# Altium schematic sheet bicycle_V1.0.SchDoc
size A3
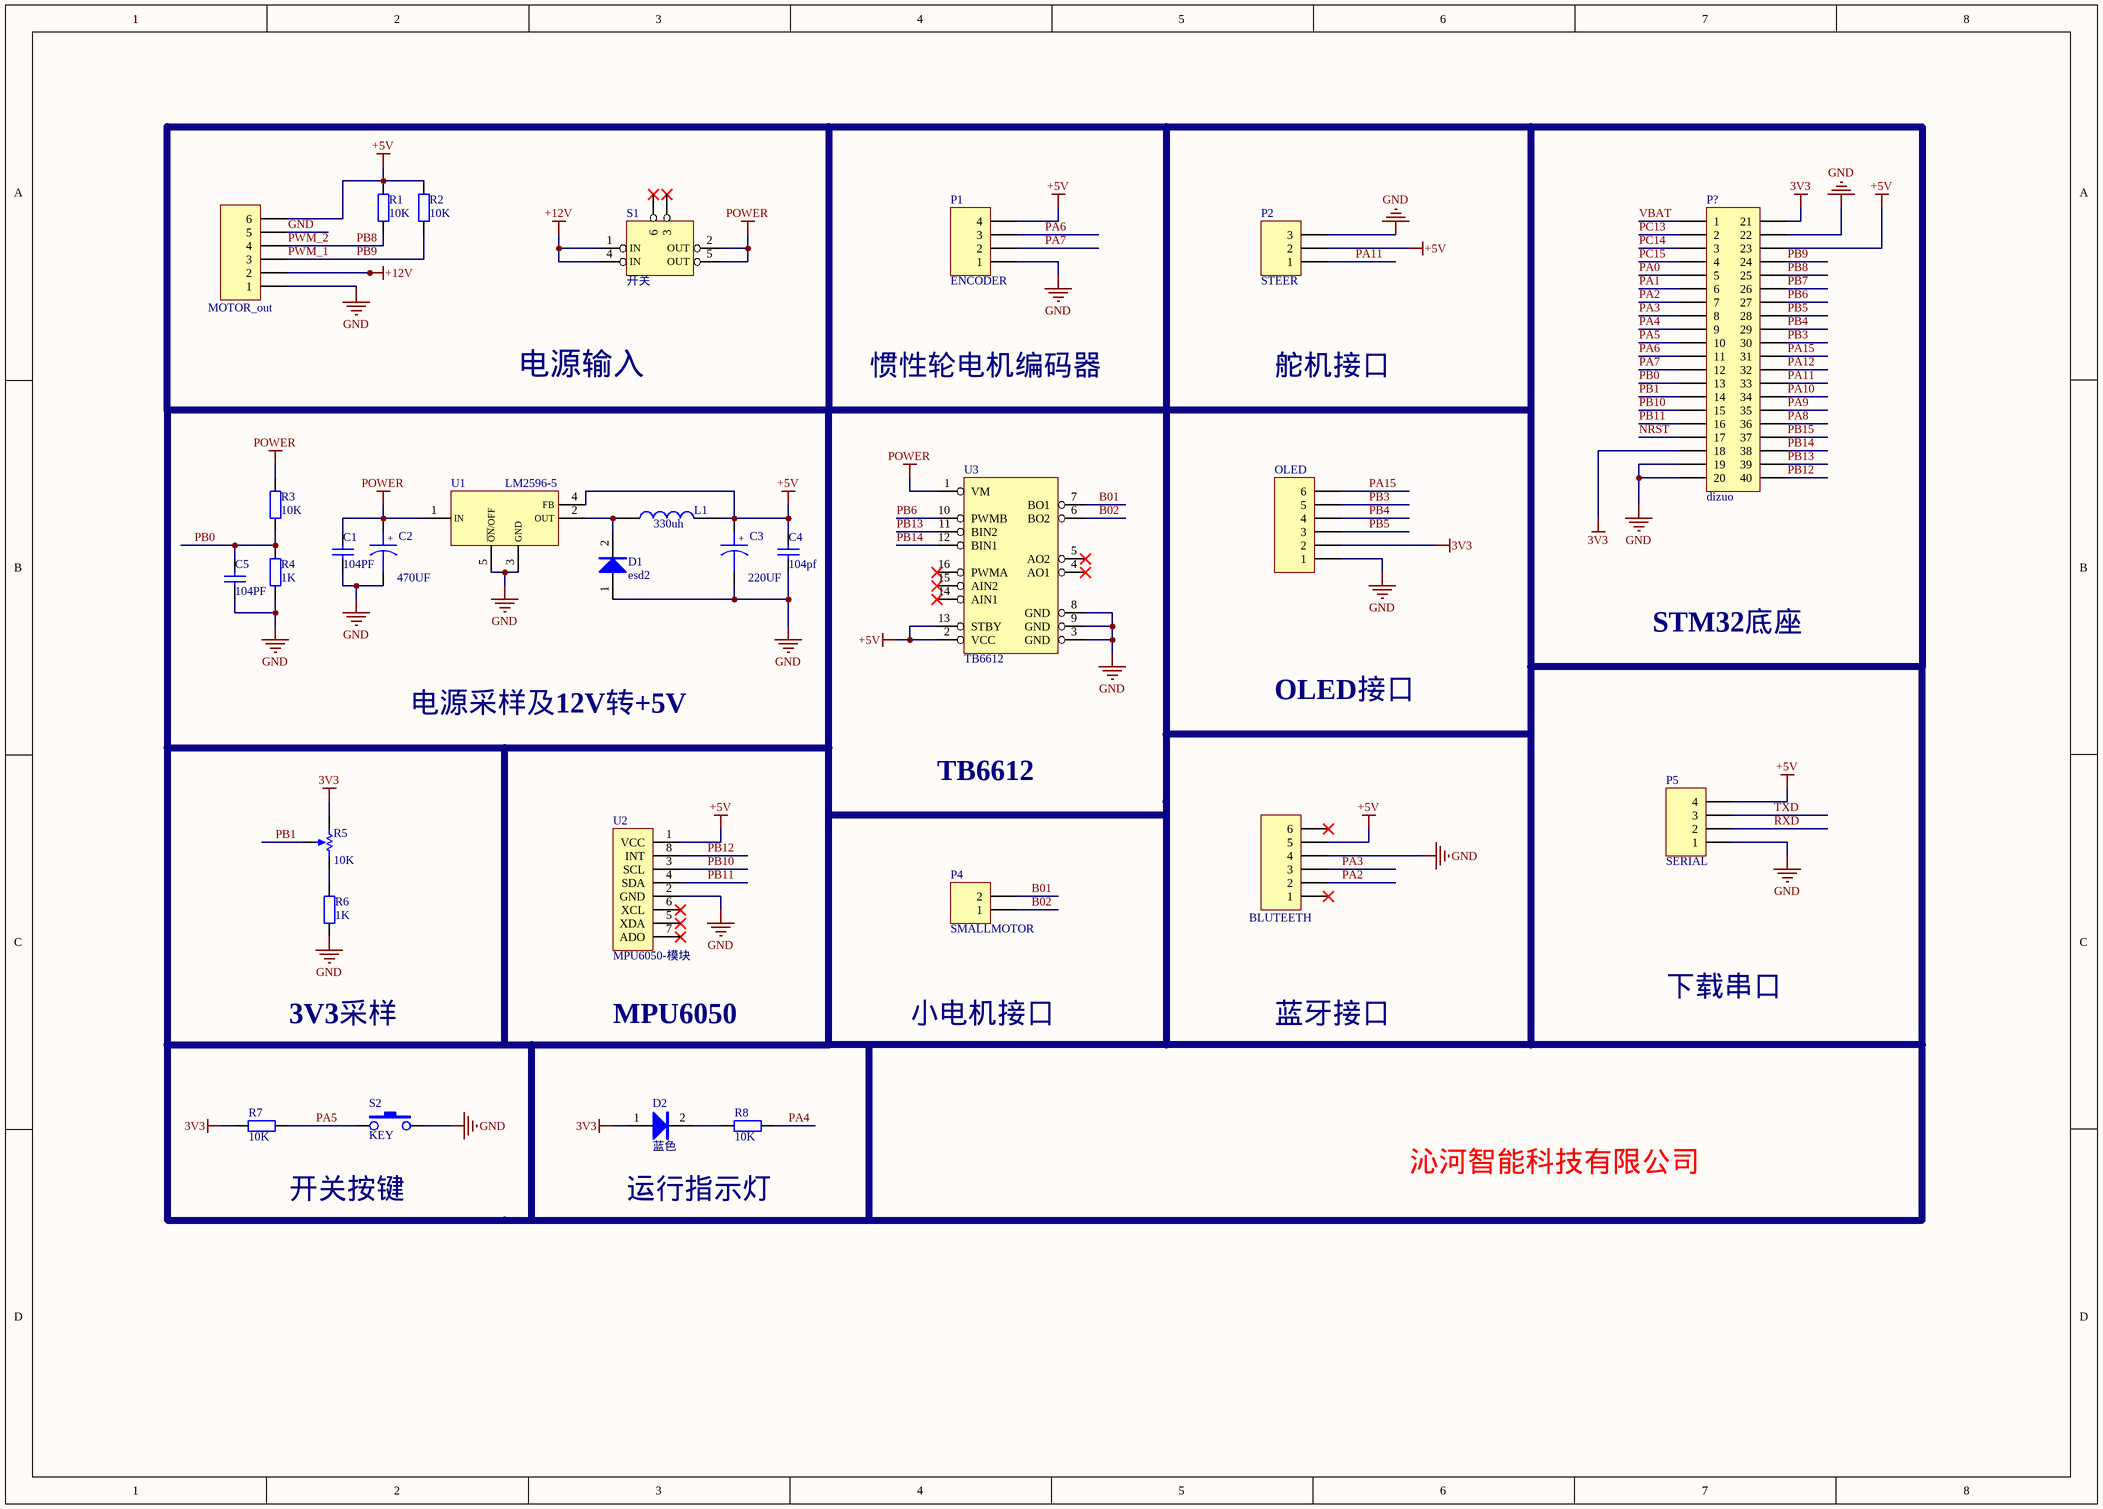
[diagram p0: bicycle_V1.0.SchDoc]

## Parts
BLUTEETH  Header 6  [MX 1.25-WI-6P]  (value not drawn)
C1  Cap  [0603L]  (value not drawn)
C2  CAP4 电解电容  [SMD-EC-F6.3]  (value not drawn)
C3  CAP4 电解电容  [SMD-EC-F6.3]  (value not drawn)
C4  Cap  [0603L]  (value not drawn)
C5  Cap  [0603L]  (value not drawn)
D1  esd2  [LC-SMB(DO-214AA)_S2]
D2  蓝色  [LC-SMB(DO-214AA)_S2]
L1  INDUCTOR 0  [L-SMD-7]  (value not drawn)
MOTOR_out  Header 6  [MX 1.25-WI-6P]  (value not drawn)
OLED  Header 6  [MX 1.25-WI-6P]  (value not drawn)
P1  ENCODER  [HDR1X4]
P2  STEER  [HDR1X3]
P4  SMALLMOTOR  [HDR1X2]
P5  SERIAL  [HDR1X4]
P?  dizuo  [stm32_kuozhan_dizuo]
R1  value 10K  [AXIAL-0.4]  (hidden comment: Res2)
R2  value 10K  [AXIAL-0.4]  (hidden comment: Res2)
R3  value 10K  [AXIAL-0.4]  (hidden comment: Res2)
R4  value 1K  [AXIAL-0.4]  (hidden comment: Res2)
R5  value 10K  [VR5]  (hidden comment: R5)
R6  value 1K  [AXIAL-0.4]  (hidden comment: Res2)
R7  value 10K  [AXIAL-0.4]  (hidden comment: Res2)
R8  value 10K  [AXIAL-0.4]  (hidden comment: Res2)
S1  开关  [SWITCH_SELFLOCKING]
S2  KEY
U1  LM2596-5  [TO-263-5]
U2  MPU6050-模块  [MPU6050]
U3  TB6612  [TB6612]

## Blocks framed on the sheet
电源输入: MOTOR_out R1 R2 S1

## Nets
3V3: D2.1 OLED.2 P?.18 P?.21 R5.1(TOP) R7.2
+5V: BLUTEETH.5 C3.1 C4.2 L1.2 MOTOR_out.6 P1.4 P2.2 P5.4 P?.23 R1.2 R2.2 U1.4(FB) U2.1(VCC) U3.2(VCC) U3.13(STBY)
+12V: MOTOR_out.2 S1.1(IN) S1.4(IN)
GND: BLUTEETH.4 C1.1 C2.2 C3.2 C4.1 C5.1 D1.1 MOTOR_out.1 MOTOR_out.5 OLED.1 P1.1 P2.3 P5.1 P?.19 P?.20 P?.22 R4.1 R6.1 S2.2 U1.3(GND) U1.5(~{ON}/OFF) U2.2(GND) U3.3(GND) U3.8(GND) U3.9(GND)
POWER: C1.2 C2.1 R3.2 S1.2(OUT) S1.5(OUT) U1.1(IN) U3.1(VM)
B01: P4.2 U3.7(BO1)
B02: P4.1 U3.6(BO2)
NRST: P?.17
PA0: P?.5
PA1: P?.6
PA2: BLUTEETH.2 P?.7
PA3: BLUTEETH.3 P?.8
PA4: P?.9 R8.1
PA5: P?.10 R7.1 S2.1
PA6: P1.3 P?.11
PA7: P1.2 P?.12
PA8: P?.36
PA9: P?.35
PA10: P?.34
PA11: P2.1 P?.33
PA12: P?.32
PA15: OLED.6 P?.31
PB0: C5.2 P?.13 R3.1 R4.2
PB1: P?.14 R5.3(TAP)
PB3: OLED.5 P?.30
PB4: OLED.4 P?.29
PB5: OLED.3 P?.28
PB6: P?.27 U3.10(PWMB)
PB7: P?.26
PB8: MOTOR_out.4 P?.25 R1.1  [also labelled PWM_2]
PB9: MOTOR_out.3 P?.24 R2.1  [also labelled PWM_1]
PB10: P?.15 U2.3(SCL)
PB11: P?.16 U2.4(SDA)
PB12: P?.40 U2.8(INT)
PB13: P?.39 U3.11(BIN2)
PB14: P?.38 U3.12(BIN1)
PB15: P?.37
PC13: P?.2
PC14: P?.3
PC15: P?.4
RXD: P5.2
TXD: P5.3
VBAT: P?.1
NetD1_2: D1.2 L1.1 U1.2(OUT)
NetD2_2: D2.2 R8.2
NetR5_2: R5.2(BOT) R6.2

Not connected (* = marked no-connect by the designer): BLUTEETH 1* 6*; S1 3* 6*; U2 5(XDA)* 6(XCL)* 7(ADO)*; U3 4(AO1)* 5(AO2)* 14(AIN1)* 15(AIN2)* 16(PWMA)*

## Notes on the sheet
- 惯性轮电机编码器
- 舵机接口
- STM32底座
- 电源采样及12V转+5V
- OLED接口
- TB6612
- 3V3采样
- MPU6050
- 小电机接口
- 蓝牙接口
- 下载串口
- 沁河智能科技有限公司
- 开关按键
- 运行指示灯
- (in symbol Cap) 104pf; 104PF
- (in symbol CAP4 电解电容) +; 220UF; 470UF
- (in symbol INDUCTOR 0) 330uh

## Library data of the parts
BLUTEETH MOTOR_out OLED = Header 6: Header, 6-Pin; LatestRevisionDate: 17-Jul-2002; LatestRevisionNote: Re-released for DXP Platform.; Publisher: Altium Limited
C1 C4 C5 = Cap: Capacitor; Published: 8-Jun-2000; LatestRevisionDate: 17-Jul-2002; LatestRevisionNote: Re-released for DXP Platform.; PackageReference: RAD-0.3; Publisher: Altium Limited
C2 C3 = CAP4 电解电容: Capacitor
D1 D2 = DIODE2
P1 P5 = Header 4: Header, 4-Pin; LatestRevisionDate: 17-Jul-2002; LatestRevisionNote: Re-released for DXP Platform.; Publisher: Altium Limited
P2 = Header 3: Header, 3-Pin; LatestRevisionDate: 17-Jul-2002; LatestRevisionNote: Re-released for DXP Platform.; Publisher: Altium Limited
P4 = Header 2: Header, 2-Pin; LatestRevisionDate: 17-Jul-2002; LatestRevisionNote: Re-released for DXP Platform.; Publisher: Altium Limited
P? = Header 20X2: Header, 20-Pin, Dual row; LatestRevisionDate: 17-Jul-2002; LatestRevisionNote: Re-released for DXP Platform.; Publisher: Altium Limited
R1-R4 R6-R8 = Res2: Resistor; Published: 8-Jun-2000; LatestRevisionDate: 17-Jul-2002; LatestRevisionNote: Re-released for DXP Platform.; PackageReference: AXIAL-0.4; Publisher: Altium Limited; PackageDescription: Axial Device, Thru-Hole; 2 Leads; 0.4 in Pin Spacing
R5 = RPot: Potentiometer; Sim Note: Enter the Resistance value and the set point into parameter fields.; Set Position: 0.5; Published: 8-Jun-2000; LatestRevisionDate: 17-Jul-2002; LatestRevisionNote: Re-released for DXP Platform.; PackageReference: VR5; Publisher: Altium Limited; PackageDescription: Variable Resistor, Thru-Hole; 3 Leads
S1 = switch
U1 = LM2560-5